# Altium schematic sheet Microwave.SchDoc
size B
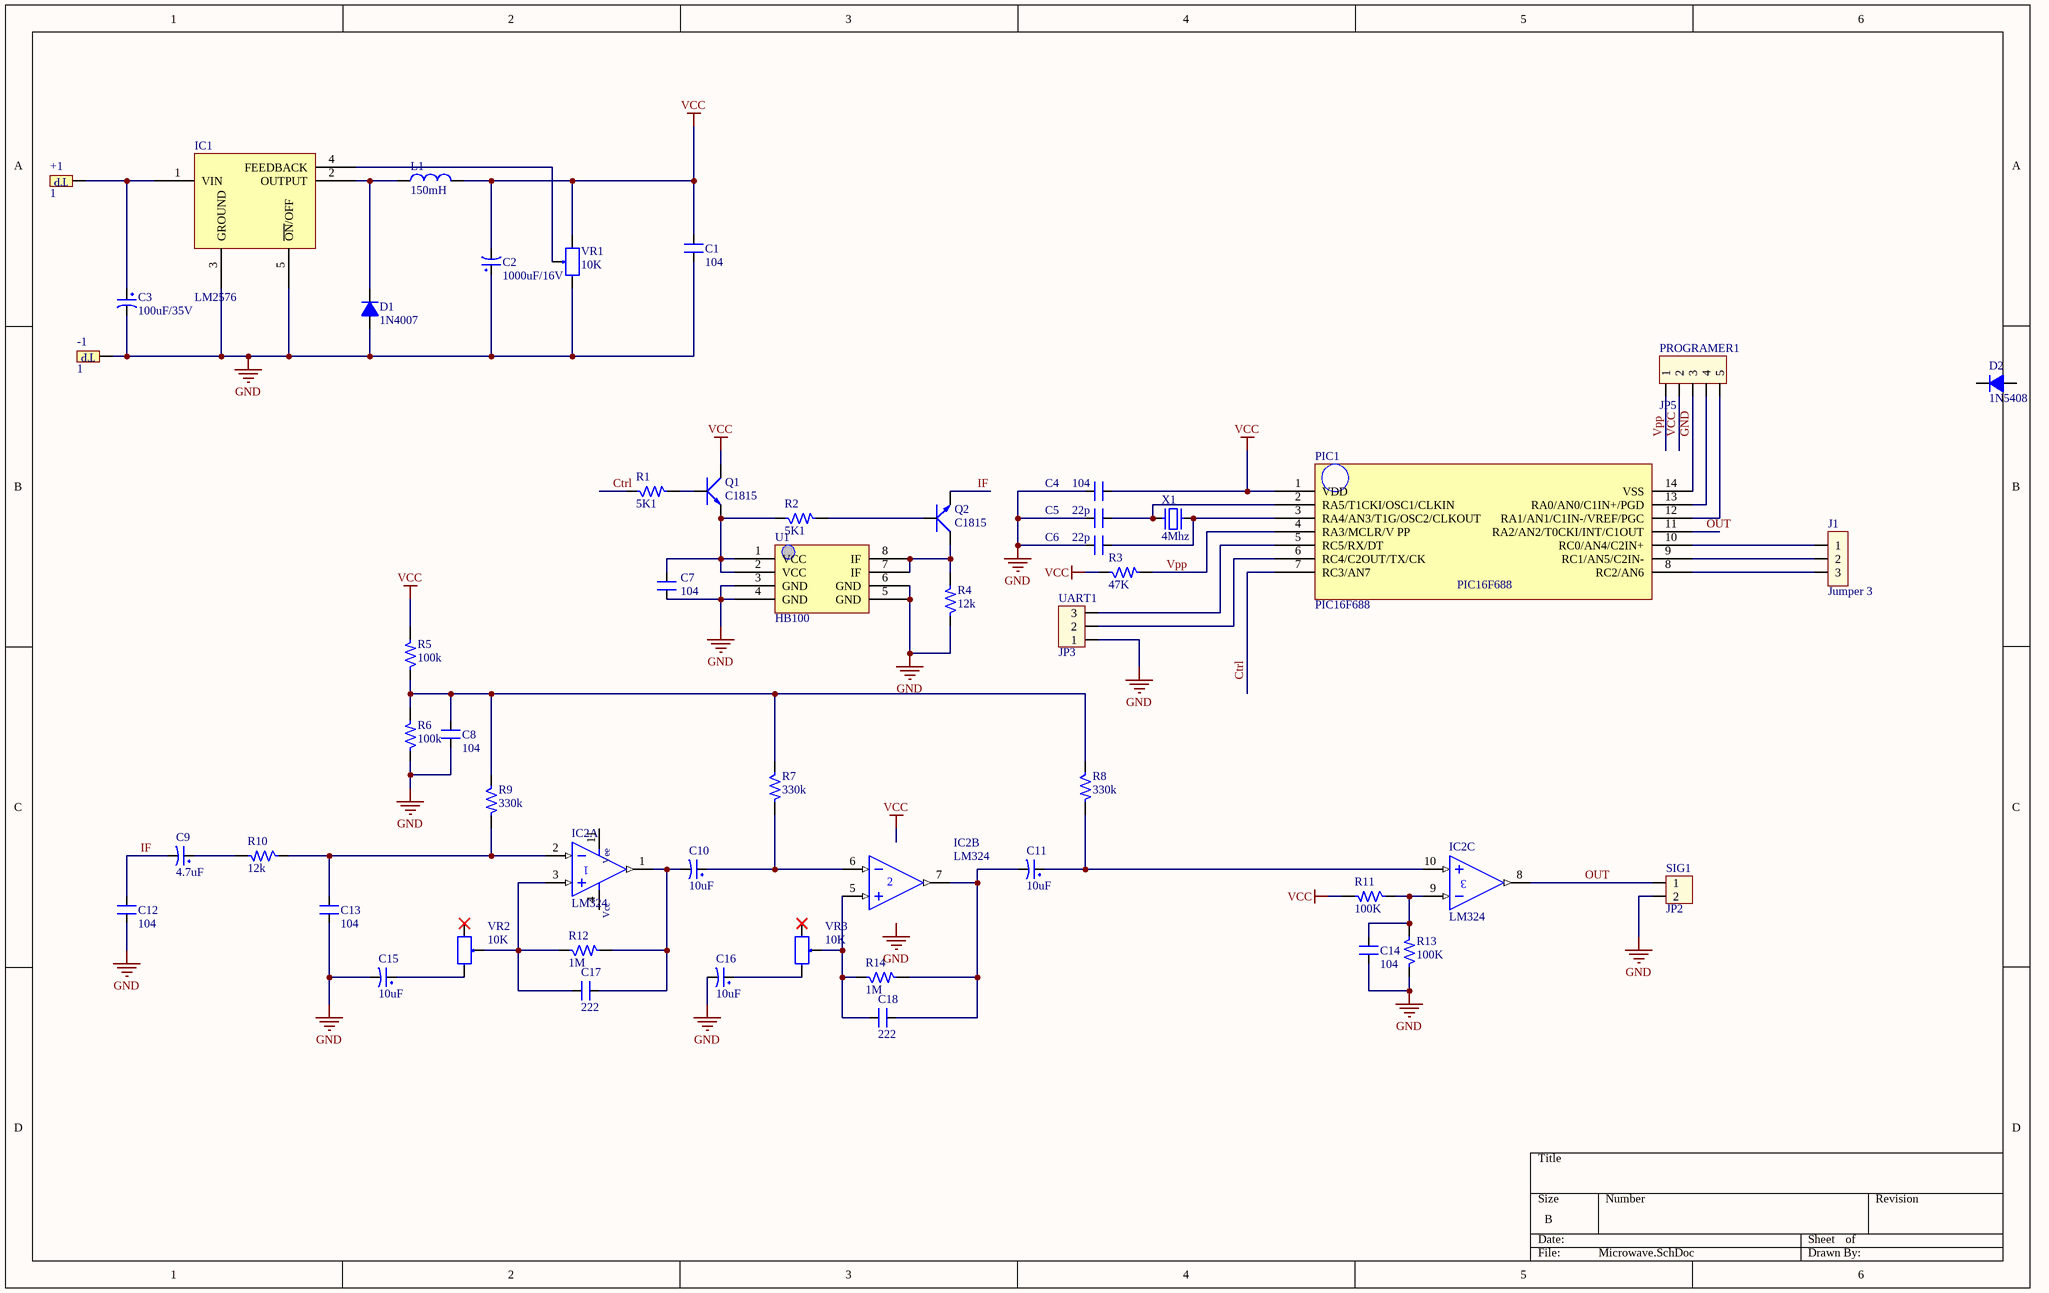
[diagram p0: Microwave.SchDoc]

## Parts
+1  1  [TP]
-1  1  [TP]
C1  104  [SM-0805]
C2  1000uF/16V  [CP1.5/3.4]
C3  100uF/35V  [CP1.5/3.4]
C4  104  [SM-0805]
C5  22p  [SM-0805]
C6  22p  [SM-0805]
C7  104  [SM-0805]
C8  104  [SM-0805]
C9  4.7uF  [CP1/2.5]
C10  10uF  [CP1/2.5]
C11  10uF  [CP1/2.5]
C12  104  [SM-0805]
C13  104  [SM-0805]
C14  104  [SM-0805]
C15  10uF  [CP1/2.5]
C16  10uF  [CP1/2.5]
C17  222  [SM-0805]
C18  222  [SM-0805]
D1  1N4007  [D2A]
D2  1N5408  [D5A]
IC1  LM2576  [936A-02]
IC2  LM324  [SO-14]  (parts A,B,C of 4)
J1  Jumper 3  [JP3]
L1  150mH  [L/0.4]
PIC1  PIC16F688  [SO-14]
PROGRAMER1  JP5  [CON5]
Q1  C1815  [SOT23B]
Q2  C1815  [SOT23B]
R1  5K1  [SM-0805]
R2  5K1  [SM-0805]
R3  47K  [SM-0805]
R4  12k  [SM-0805]
R5  100k  [SM-0805]
R6  100k  [SM-0805]
R7  330k  [SM-0805]
R8  330k  [SM-0805]
R9  330k  [SM-0805]
R10  12k  [SM-0805]
R11  100K  [SM-0805]
R12  1M  [SM-0805]
R13  100K  [SM-0805]
R14  1M  [SM-0805]
SIG1  JP2  [CON2]
U1  HB100  [HB100_SENSOR]
UART1  JP3  [CON3]
VR1  10K  [VR1]
VR2  10K  [VR]
VR3  10K  [VR]
X1  4Mhz  [XT2]

## Nets
GND: -1.TP1 C1.1 C2.1 C3.2 C4.1 C5.1 C6.1 C7.1 C8.1 C12.1 C13.1 C14.1 C15.2 C16.2 D1.1(A) IC1.3(GROUND) IC1.5(~{ON}/OFF) PIC1.14(VSS) PROGRAMER1.3 R4.1 R6.1 R13.1 SIG1.2 U1.3(GND) U1.4(GND) U1.5(GND) U1.6(GND) UART1.1 VR1.3
VCC: C1.2 C2.2 C4.2 L1.2 PIC1.1(VDD) PROGRAMER1.2 Q1.2(C) R3.1 R5.2 R11.2 VR1.1
Ctrl: PIC1.7(RC3/AN7) R1.1
IF: C9.2 C12.2 Q2.1(E)
OUT: IC2.8(OUT) PIC1.11(RA2/AN2/T0CKI/INT/C1OUT) SIG1.1
Vpp: PIC1.4(RA3/MCLR/V_PP) PROGRAMER1.1 R3.2
Net+1_TP1: +1.TP1 C3.1 IC1.1(VIN)
NetC5_2: C5.2 PIC1.2(RA5/T1CKI/OSC1/CLKIN) X1.1
NetC6_2: C6.2 PIC1.3(RA4/AN3/T1G/OSC2/CLKOUT) X1.2
NetC7_2: C7.2 Q1.1(E) R2.1 U1.1(VCC) U1.2(VCC)
NetC8_2: C8.2 R5.1 R6.2 R7.1 R8.1 R9.1
NetC9_1: C9.1 R10.2
NetC10_1: C10.1 IC2.6(IN-) R7.2
NetC10_2: C10.2 C17.2 IC2.1(OUT) R12.2
NetC11_1: C11.1 IC2.10(IN+) R8.2
NetC11_2: C11.2 C18.2 IC2.7(OUT) R14.2
NetC13_2: C13.2 IC2.2(IN-) R9.2 R10.1
NetC14_2: C14.2 IC2.9(IN-) R11.1 R13.2
NetC15_1: C15.1 VR2.3
NetC16_1: C16.1 VR3.3
NetC17_1: C17.1 IC2.3(IN+) R12.1 VR2.2
NetC18_1: C18.1 IC2.5(IN+) R14.1 VR3.2
NetD1_2: D1.2(K) IC1.2(OUTPUT) L1.1
NetIC1_4: IC1.4(FEEDBACK) VR1.2
NetJ1_1: J1.1 PIC1.10(RC0/AN4/C2IN+)
NetJ1_2: J1.2 PIC1.9(RC1/AN5/C2IN-)
NetJ1_3: J1.3 PIC1.8(RC2/AN6)
NetPIC1_5: PIC1.5(RC5/RX/DT) UART1.3
NetPIC1_6: PIC1.6(RC4/C2OUT/TX/CK) UART1.2
NetPIC1_12: PIC1.12(RA1/AN1/C1IN-/VREF/PGC) PROGRAMER1.5
NetPIC1_13: PIC1.13(RA0/AN0/C1IN+/PGD) PROGRAMER1.4
NetQ1_3: Q1.3(B) R1.2
NetQ2_2: Q2.2(C) R4.2 U1.7(IF) U1.8(IF)
NetQ2_3: Q2.3(B) R2.2

Not connected (* = marked no-connect by the designer): D2 1(A) 2(K); IC2 4(V+) 11(V-); VR2 1*; VR3 1*

## Notes on the sheet
- Labels drawn without touching a wire or pin: GND
- (in symbol LM324, part A) Vee; Vcc

## Library data of the parts
+1 -1 = TP: CONNECT 1
C1 C7 C8 C12-C14 C17 C18 = CN2: Cap np 104 => 105pF; Value: 0.1uF; Description: Cap np Cremic Value  104pF => 105pF
C2 = CP4: Cap 1000uF/16V - 220uF/50V; Description 5: 4,7uF>10uF/250V_3,3uF>10uF/400V - 2,2uF>4,7uF/450V; Description 1: 2200uF-3300uF/6,3V - 1000uF-2200uF/10V; Description 2: 1000uF/16V - 470uF => 1000uF/25V - 100uF/100V; Description 3: 330uF>470uF/35V_220uF>470uF/50V_10uF>22uF/250V; Description 4: 220uF => 330uF/63V - 10uF =>33uF/160 - 200V; Value: 1000uF/16V
C3 = CP3: Cap 100uF/35V - 470uF/16V; Value: 100uF/35V/50V; Description 1: 1000uF/6,3V - 470uF/16V - 330uF - 25V; Description 2: 220uF/35V - 100uF/50V - 63V - 4,7uF/200V; Description 3: 22uF => 33uF100V - 3,3uF => 4,7uF/250V; Description 4: 2,2uF =>3,3uF/350 - 2,2uF/400V - 1uF/450V
C4-C6 = CM: Cap SMD; Value: 103
C9-C11 C15 C16 = CP1: Cap P  0,1uF < 22uF , 16 - 50V; Value: 10uF/50V; Description 1: 10 => 220uF/6,3V/10V - 10uF => 100uF/16V; Description 2: 0,1uF => 33uF/50V - 10uF => 22uF/63V; Description 3: 0,47uF => 10uF/100V
D1 = D1A: Diode 1A; Value: 1N4007
D2 = D5A: Diode 5A; Value: 1N5408
IC2 = LM324: Op x 4; Value: LM324
J1 = JP3: Value: J3
L1 = L1: Inductor; Value: 150 mH
PROGRAMER1 = Con5: Connector 5; Value: Connector 5
Q1 Q2 = C1815: NPN 600mW, ECB; Value: C1815
R1-R14 = R: Resistor 1/4W; Value: R1/4W - 1K
SIG1 = Con2: Connector 2; Value: Connector 2
U1 = HB100_SENSOR
UART1 = Con3: Connector 3; Value: Connector 3
VR1-VR3 = VR: Var Resistor; Value: VR 10K
X1 = XT2: Crystal For all Crystal 2pin.; Value: 4Mhz